# EAGLE schematic Led_matrix (EAGLE 7.2.0)
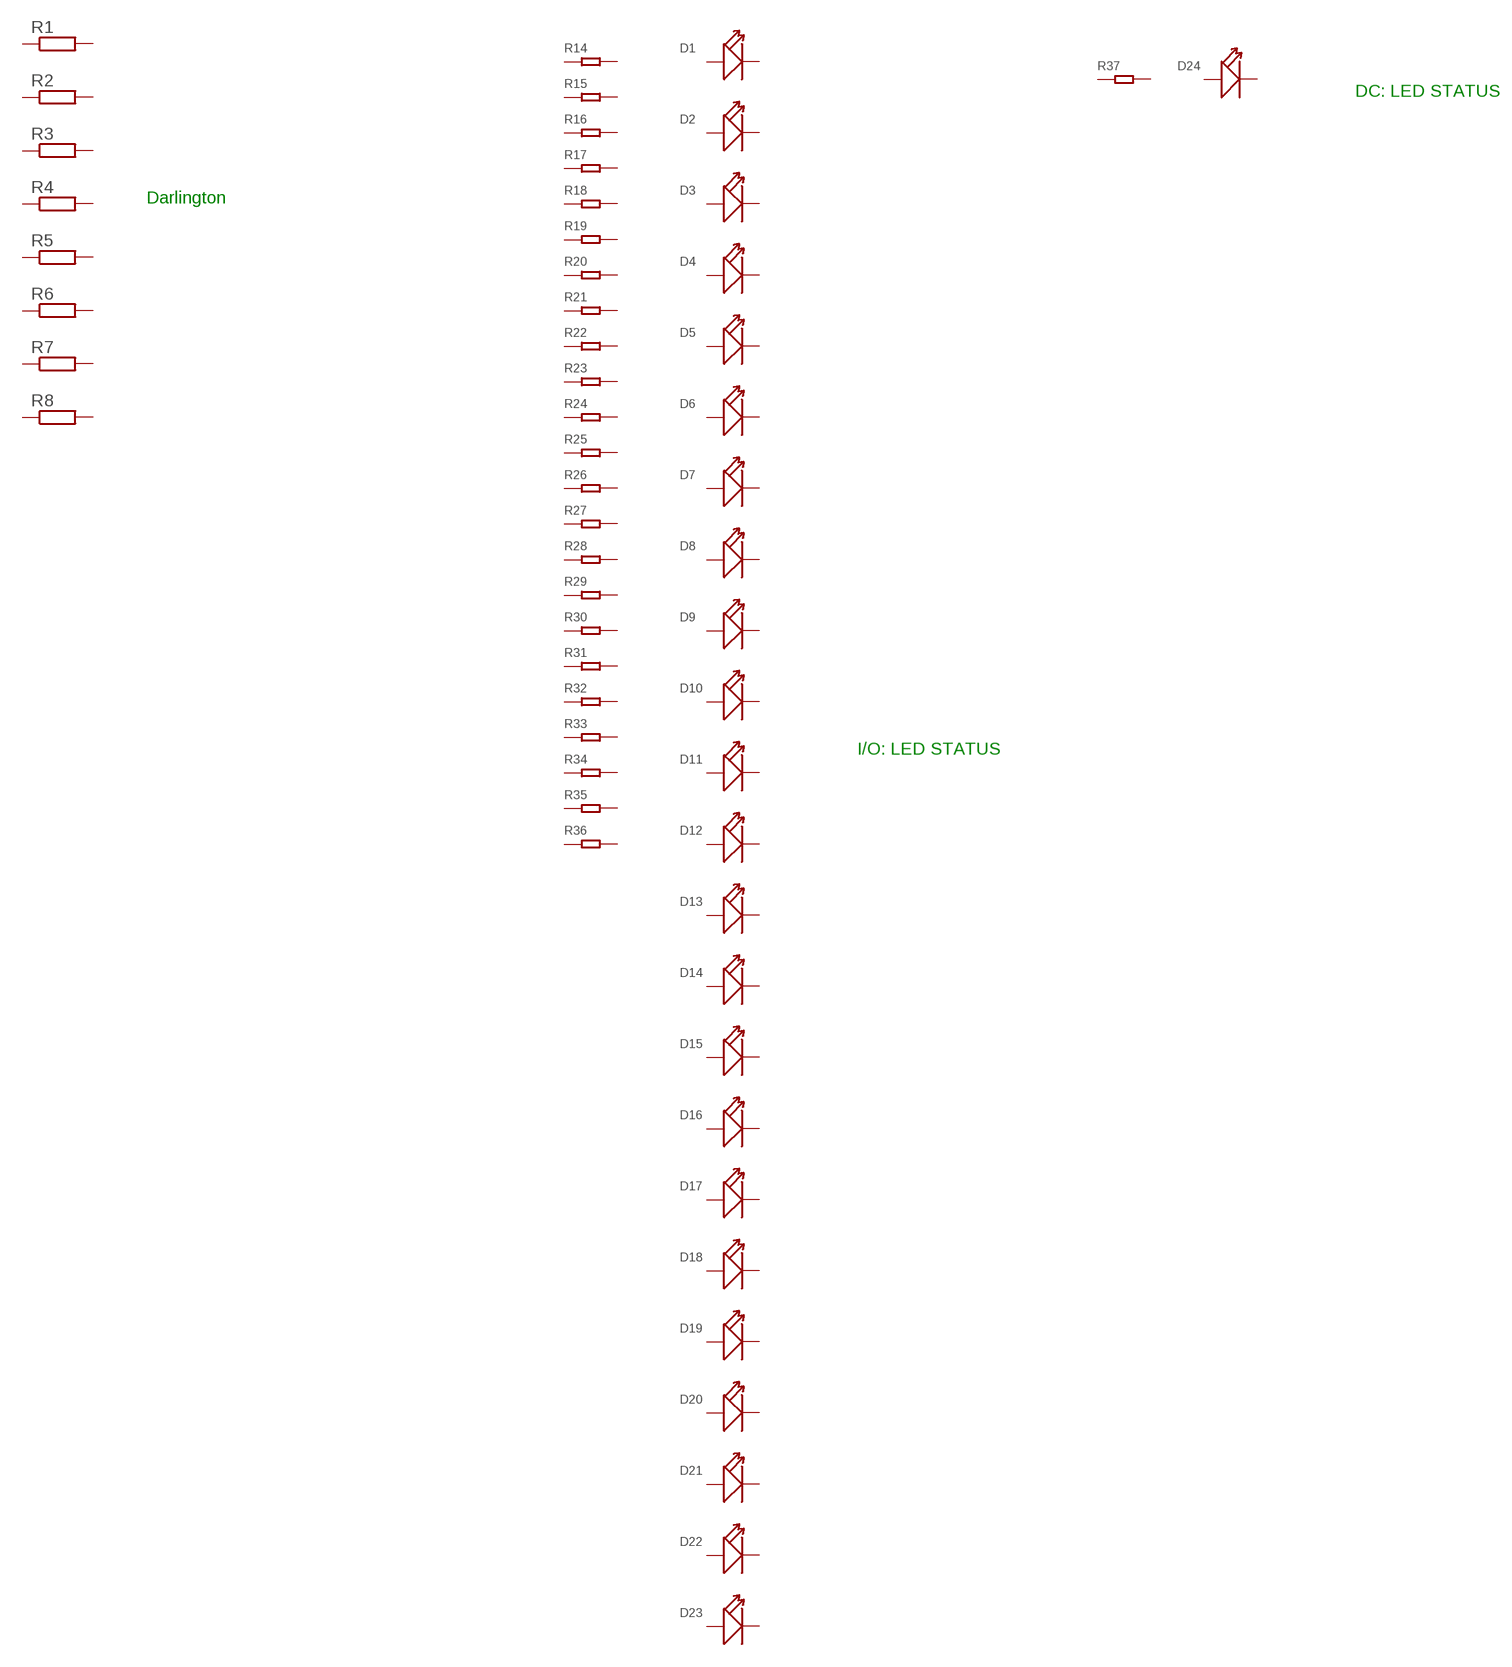
[diagram p0: schematic, sheet 1, part 1 of 2]
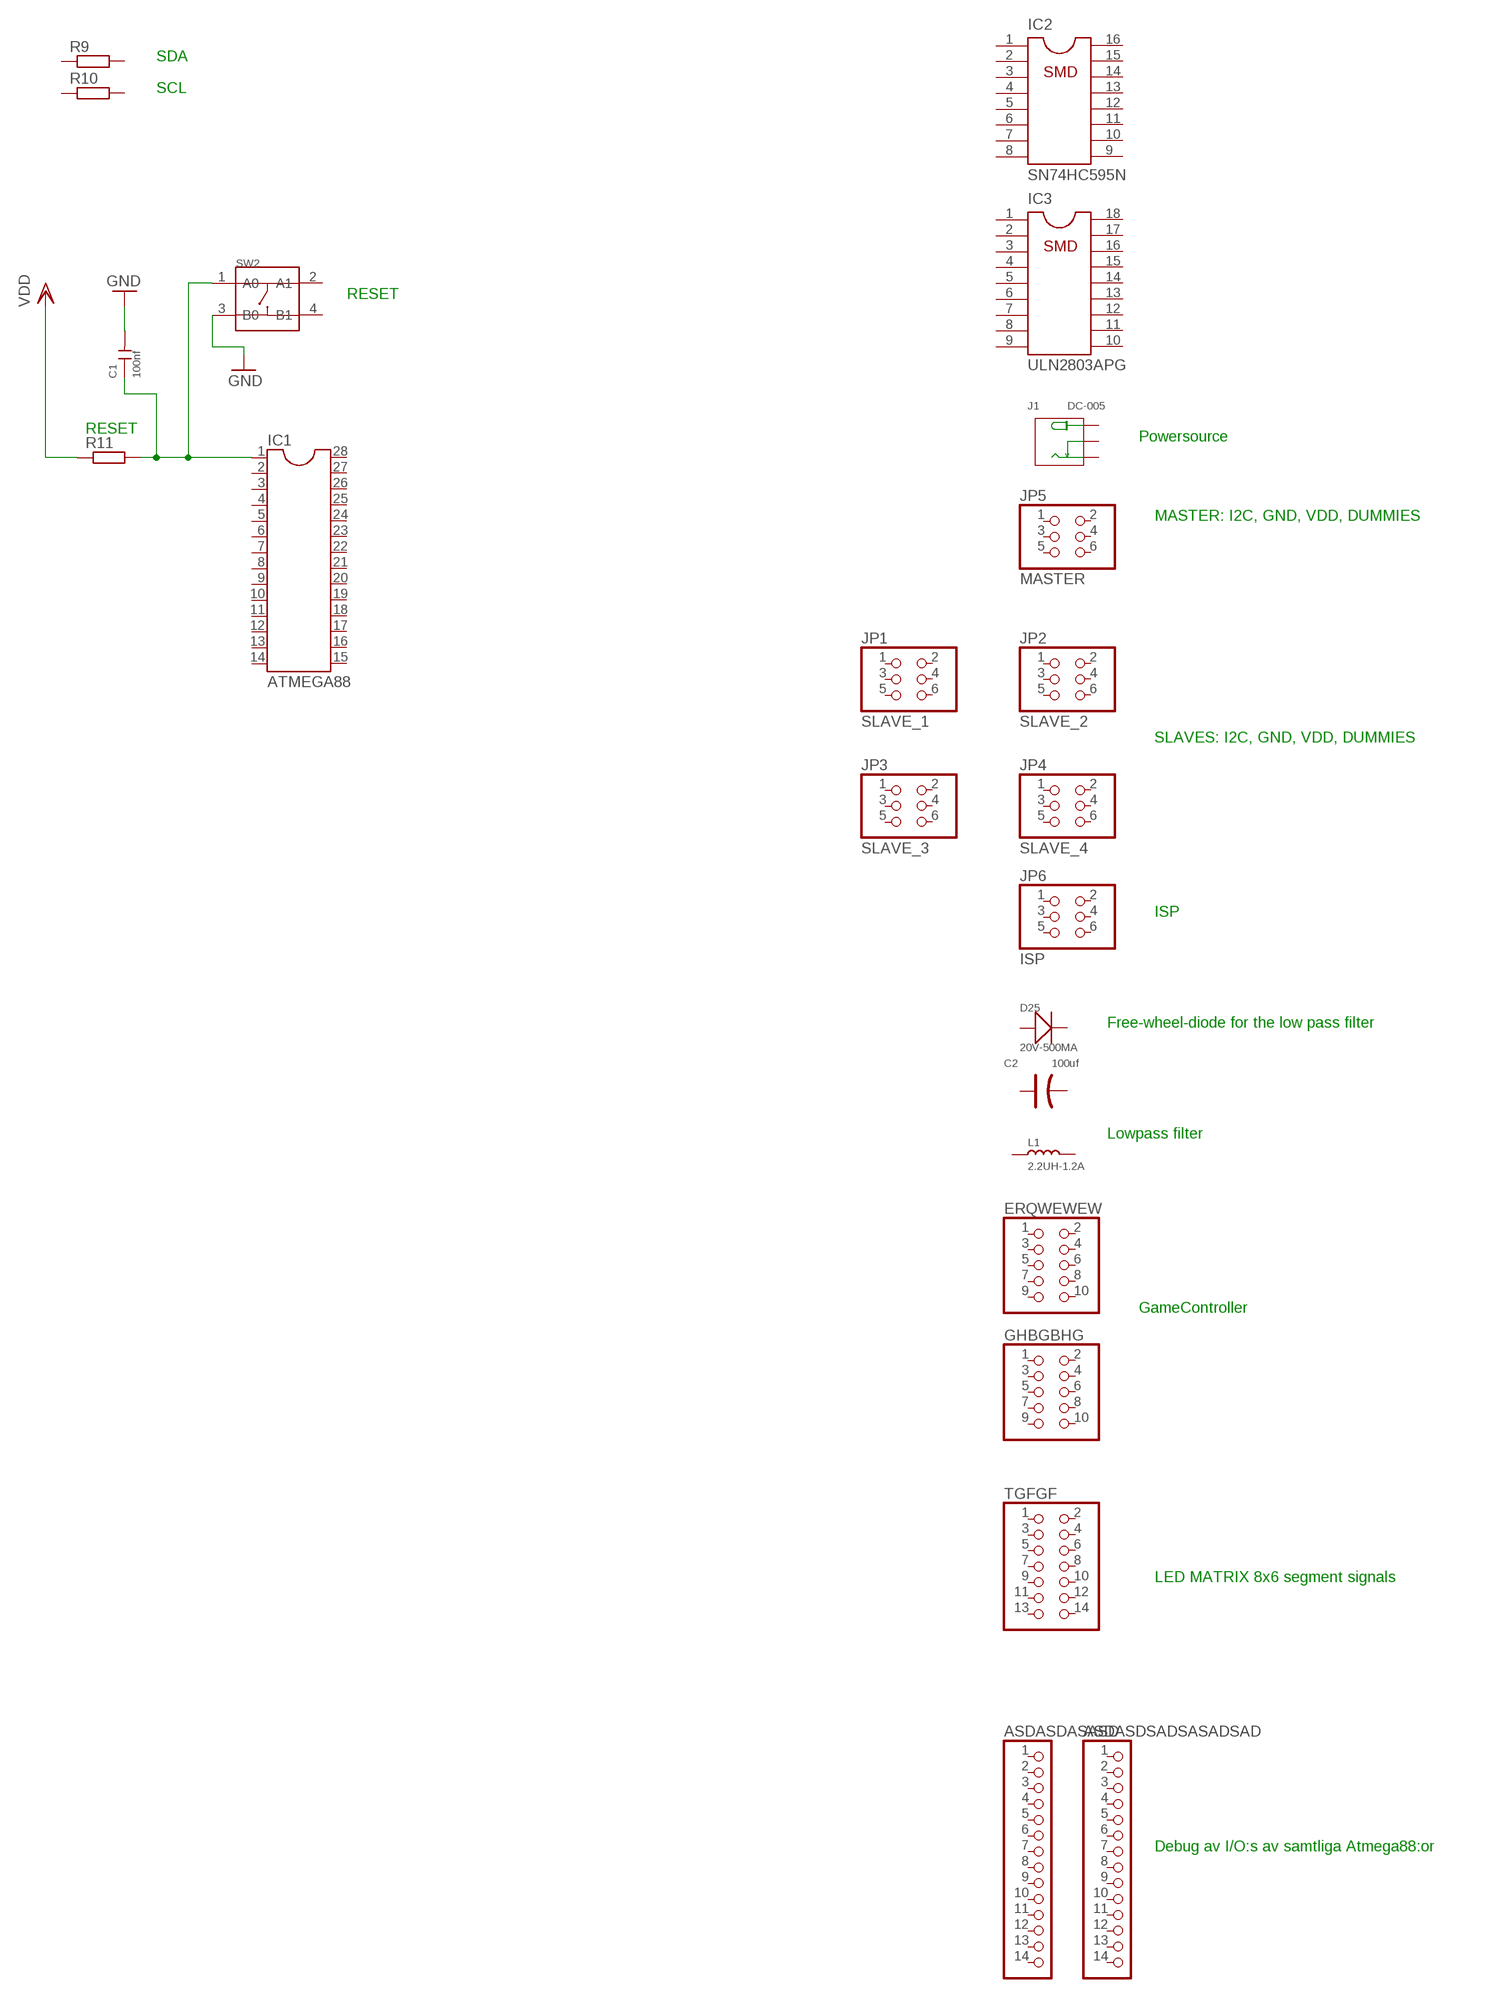
[diagram p1: schematic, sheet 1, part 2 of 2]

## Parts
ASDASDASASD  PINHD-1X14  [1X14]
ASDASDSADSASADSAD  PINHD-1X14  [1X14]
C1  100nf  DIP-CERAMIC-DISC-100NF-50V-Y5V(D5.0MM)  [CERAMIC-2.54]
C2  100uf  DIP-ALUMINUM-100UF-16V(D5-H7MM)  [PC-D5.3MM]
D1  SMD-LED-CLEAR-GREEN(0603)  [LED-0603]
D2  SMD-LED-CLEAR-GREEN(0603)  [LED-0603]
D3  SMD-LED-CLEAR-GREEN(0603)  [LED-0603]
D4  SMD-LED-CLEAR-GREEN(0603)  [LED-0603]
D5  SMD-LED-CLEAR-GREEN(0603)  [LED-0603]
D6  SMD-LED-CLEAR-GREEN(0603)  [LED-0603]
D7  SMD-LED-CLEAR-GREEN(0603)  [LED-0603]
D8  SMD-LED-CLEAR-GREEN(0603)  [LED-0603]
D9  SMD-LED-CLEAR-GREEN(0603)  [LED-0603]
D10  SMD-LED-CLEAR-GREEN(0603)  [LED-0603]
D11  SMD-LED-CLEAR-GREEN(0603)  [LED-0603]
D12  SMD-LED-CLEAR-GREEN(0603)  [LED-0603]
D13  SMD-LED-CLEAR-GREEN(0603)  [LED-0603]
D14  SMD-LED-CLEAR-GREEN(0603)  [LED-0603]
D15  SMD-LED-CLEAR-GREEN(0603)  [LED-0603]
D16  SMD-LED-CLEAR-GREEN(0603)  [LED-0603]
D17  SMD-LED-CLEAR-GREEN(0603)  [LED-0603]
D18  SMD-LED-CLEAR-GREEN(0603)  [LED-0603]
D19  SMD-LED-CLEAR-GREEN(0603)  [LED-0603]
D20  SMD-LED-CLEAR-GREEN(0603)  [LED-0603]
D21  SMD-LED-CLEAR-GREEN(0603)  [LED-0603]
D22  SMD-LED-CLEAR-GREEN(0603)  [LED-0603]
D23  SMD-LED-CLEAR-GREEN(0603)  [LED-0603]
D24  SMD-LED-CLEAR-GREEN(0603)  [LED-0603]
D25  20V-500MA  SMD-DIODE-SCHOTTKY-20V-500MA(SOD-123)P  [SOD-123]
ERQWEWEW  PINHD-2X5  [2X05]
GHBGBHG  PINHD-2X5  [2X05]
IC1  ATMEGA88  DIL28-3  [DIL28-3]
IC2  SN74HC595N  DIL16-SMD  [DIL16-SMD]
IC3  ULN2803APG  DIL18-SMD  [DIL18-SMD]
J1  DC-005  CONN-POWER-JACK-2.1MM(DC-005)  [DCJ3P-14.2X11.0X9.0MM]
JP1  SLAVE_1  PINHD-2X3-SMD  [2X03-SMD]
JP2  SLAVE_2  PINHD-2X3-SMD  [2X03-SMD]
JP3  SLAVE_3  PINHD-2X3-SMD  [2X03-SMD]
JP4  SLAVE_4  PINHD-2X3-SMD  [2X03-SMD]
JP5  MASTER  PINHD-2X3-SMD  [2X03-SMD]
JP6  ISP  PINHD-2X3-SHROUDED  [2X03-SHROUDED]
L1  2.2UH-1.2A  SMD-INDUCTOR-2.2UH-20%-1.2A(0805)  [L0805]
R1  R-EU_0411/15  [0411/15]
R2  R-EU_0411/15  [0411/15]
R3  R-EU_0411/15  [0411/15]
R4  R-EU_0411/15  [0411/15]
R5  R-EU_0411/15  [0411/15]
R6  R-EU_0411/15  [0411/15]
R7  R-EU_0411/15  [0411/15]
R8  R-EU_0411/15  [0411/15]
R9  R-EU_0207/10  [0207/10]
R10  R-EU_0207/10  [0207/10]
R11  R-EU_0207/10  [0207/10]
R14  SMD-RES-100R-5%-1/10W(0603)  [R0603]
R15  SMD-RES-100R-5%-1/10W(0603)  [R0603]
R16  SMD-RES-100R-5%-1/10W(0603)  [R0603]
R17  SMD-RES-100R-5%-1/10W(0603)  [R0603]
R18  SMD-RES-100R-5%-1/10W(0603)  [R0603]
R19  SMD-RES-100R-5%-1/10W(0603)  [R0603]
R20  SMD-RES-100R-5%-1/10W(0603)  [R0603]
R21  SMD-RES-100R-5%-1/10W(0603)  [R0603]
R22  SMD-RES-100R-5%-1/10W(0603)  [R0603]
R23  SMD-RES-100R-5%-1/10W(0603)  [R0603]
R24  SMD-RES-100R-5%-1/10W(0603)  [R0603]
R25  SMD-RES-100R-5%-1/10W(0603)  [R0603]
R26  SMD-RES-100R-5%-1/10W(0603)  [R0603]
R27  SMD-RES-100R-5%-1/10W(0603)  [R0603]
R28  SMD-RES-100R-5%-1/10W(0603)  [R0603]
R29  SMD-RES-100R-5%-1/10W(0603)  [R0603]
R30  SMD-RES-100R-5%-1/10W(0603)  [R0603]
R31  SMD-RES-100R-5%-1/10W(0603)  [R0603]
R32  SMD-RES-100R-5%-1/10W(0603)  [R0603]
R33  SMD-RES-100R-5%-1/10W(0603)  [R0603]
R34  SMD-RES-100R-5%-1/10W(0603)  [R0603]
R35  SMD-RES-100R-5%-1/10W(0603)  [R0603]
R36  SMD-RES-100R-5%-1/10W(0603)  [R0603]
R37  SMD-RES-100R-5%-1/10W(0603)  [R0603]
SW2  SMD-BUTTON(4P-6.0X6.0X7.5MM)  [SW4-4.5-6.0X6.0X7.5MM]
TGFGF  PINHD-2X7  [2X07]

## Nets
GND: C1.2 SW2.3(B0)
N$1: C1.1 IC1.1 R11.2 SW2.1(A0)
VDD: R11.1
Unconnected: ASDASDASASD.1 ASDASDASASD.2 ASDASDASASD.3 ASDASDASASD.4 ASDASDASASD.5 ASDASDASASD.6 ASDASDASASD.7 ASDASDASASD.8 ASDASDASASD.9 ASDASDASASD.10 ASDASDASASD.11 ASDASDASASD.12 ASDASDASASD.13 ASDASDASASD.14 ASDASDSADSASADSAD.1 ASDASDSADSASADSAD.2 ASDASDSADSASADSAD.3 ASDASDSADSASADSAD.4 ASDASDSADSASADSAD.5 ASDASDSADSASADSAD.6 ASDASDSADSASADSAD.7 ASDASDSADSASADSAD.8 ASDASDSADSASADSAD.9 ASDASDSADSASADSAD.10 ASDASDSADSASADSAD.11 ASDASDSADSASADSAD.12 ASDASDSADSASADSAD.13 ASDASDSADSASADSAD.14 C2.+ C2.- D1.+ D1.- D2.+ D2.- D3.+ D3.- D4.+ D4.- D5.+ D5.- D6.+ D6.- D7.+ D7.- D8.+ D8.- D9.+ D9.- D10.+ D10.- D11.+ D11.- D12.+ D12.- D13.+ D13.- D14.+ D14.- D15.+ D15.- D16.+ D16.- D17.+ D17.- D18.+ D18.- D19.+ D19.- D20.+ D20.- D21.+ D21.- D22.+ D22.- D23.+ D23.- D24.+ D24.- D25.+ D25.- ERQWEWEW.1 ERQWEWEW.2 ERQWEWEW.3 ERQWEWEW.4 ERQWEWEW.5 ERQWEWEW.6 ERQWEWEW.7 ERQWEWEW.8 ERQWEWEW.9 ERQWEWEW.10 GHBGBHG.1 GHBGBHG.2 GHBGBHG.3 GHBGBHG.4 GHBGBHG.5 GHBGBHG.6 GHBGBHG.7 GHBGBHG.8 GHBGBHG.9 GHBGBHG.10 IC1.2 IC1.3 IC1.4 IC1.5 IC1.6 IC1.7 IC1.8 IC1.9 IC1.10 IC1.11 IC1.12 IC1.13 IC1.14 IC1.15 IC1.16 IC1.17 IC1.18 IC1.19 IC1.20 IC1.21 IC1.22 IC1.23 IC1.24 IC1.25 IC1.26 IC1.27 IC1.28 IC2.1 IC2.2 IC2.3 IC2.4 IC2.5 IC2.6 IC2.7 IC2.8 IC2.9 IC2.10 IC2.11 IC2.12 IC2.13 IC2.14 IC2.15 IC2.16 IC3.1 IC3.2 IC3.3 IC3.4 IC3.5 IC3.6 IC3.7 IC3.8 IC3.9 IC3.10 IC3.11 IC3.12 IC3.13 IC3.14 IC3.15 IC3.16 IC3.17 IC3.18 J1.+ J1.-1(-) J1.-2(CDN) JP1.1 JP1.2 JP1.3 JP1.4 JP1.5 JP1.6 JP2.1 JP2.2 JP2.3 JP2.4 JP2.5 JP2.6 JP3.1 JP3.2 JP3.3 JP3.4 JP3.5 JP3.6 JP4.1 JP4.2 JP4.3 JP4.4 JP4.5 JP4.6 JP5.1 JP5.2 JP5.3 JP5.4 JP5.5 JP5.6 JP6.1 JP6.2 JP6.3 JP6.4 JP6.5 JP6.6 L1.1 L1.2 R1.1 R1.2 R2.1 R2.2 R3.1 R3.2 R4.1 R4.2 R5.1 R5.2 R6.1 R6.2 R7.1 R7.2 R8.1 R8.2 R9.1 R9.2 R10.1 R10.2 R14.1 R14.2 R15.1 R15.2 R16.1 R16.2 R17.1 R17.2 R18.1 R18.2 R19.1 R19.2 R20.1 R20.2 R21.1 R21.2 R22.1 R22.2 R23.1 R23.2 R24.1 R24.2 R25.1 R25.2 R26.1 R26.2 R27.1 R27.2 R28.1 R28.2 R29.1 R29.2 R30.1 R30.2 R31.1 R31.2 R32.1 R32.2 R33.1 R33.2 R34.1 R34.2 R35.1 R35.2 R36.1 R36.2 R37.1 R37.2 SW2.2(A1) SW2.4(B1) TGFGF.1 TGFGF.2 TGFGF.3 TGFGF.4 TGFGF.5 TGFGF.6 TGFGF.7 TGFGF.8 TGFGF.9 TGFGF.10 TGFGF.11 TGFGF.12 TGFGF.13 TGFGF.14

## Notes on the sheet
- DC: LED STATUS
- Darlington
- I/O: LED STATUS
- SDA
- SCL
- RESET
- RESET
- Powersource
- MASTER: I2C, GND, VDD, DUMMIES
- SLAVES: I2C, GND, VDD, DUMMIES
- ISP
- Free-wheel-diode for the low pass filter
- Lowpass filter
- GameController
- LED MATRIX 8x6 segment signals
- Debug av I/O:s av samtliga Atmega88:or

## Library data of the parts
ASDASDASASD ASDASDSADSASADSAD = pinhead:PINHD-1X14: PIN HEADER
C1 = OPL-Capacitor:DIP-CERAMIC-DISC-100NF-50V-Y5V(D5.0MM): 302010208; MPN: CC1-F5SL2A101KSPW
C2 = OPL-Capacitor:DIP-ALUMINUM-100UF-16V(D5-H7MM): 302030031
D1-D24 = OPL-Diode:SMD-LED-CLEAR-GREEN(0603): 304090043; MPN: 19-217-G7C-AN1P2-3T; VALUE: GREEN-0603
D25 = OPL-Diode:SMD-DIODE-SCHOTTKY-20V-500MA(SOD-123)P: 304020032; MPN: SS0520-7-F
ERQWEWEW GHBGBHG = pinhead:PINHD-2X5: PIN HEADER
IC1 = custom-ic-package:DIL28: Dual In Line
IC2 = custom-ic-package:DIL16-SMD
IC3 = custom-ic-package:DIL18-SMD
J1 = OPL-Connector:CONN-POWER-JACK-2.1MM(DC-005): 320120003; MPN: DC-005
JP1-JP5 = custom-pinhead:PINHD-2X3-SMD
JP6 = custom-pinhead:PINHD-2X3-SHROUDED
L1 = OPL-Inductor:SMD-INDUCTOR-2.2UH-20%-1.2A(0805): 303010086; MPN: LQM2MPN2R2MG0
R1-R11 = resistor:R-EU_: RESISTOR, European symbol
R14-R37 = OPL-Resistor:SMD-RES-100R-5%-1/10W(0603): 301010090; MPN: RC0603JR-07100RL; VALUE: 100R
SW2 = OPL-Switch:SMD-BUTTON(4P-6.0X6.0X7.5MM): 311020022
TGFGF = pinhead:PINHD-2X7: PIN HEADER